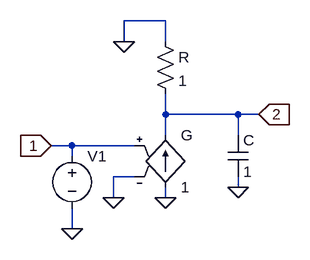
[diagram p0: schematic CS_ref_amp.asc]
CS_ref_amp.asc, the LTspice schematic file:
Version 4
SHEET 1 880 680
WIRE -64 -16 -128 -16
WIRE -128 16 -128 -16
WIRE -64 16 -64 -16
WIRE -64 128 -64 96
WIRE 48 128 -64 128
WIRE 80 128 48 128
WIRE -64 160 -64 128
WIRE 48 160 48 128
WIRE -208 176 -240 176
WIRE -112 176 -208 176
WIRE -208 192 -208 176
WIRE -112 224 -144 224
WIRE 48 240 48 224
WIRE -144 256 -144 224
WIRE -64 256 -64 240
WIRE -208 304 -208 272
FLAG -64 256 0
FLAG -240 176 1
IOPIN -240 176 In
FLAG 48 240 0
FLAG 80 128 2
IOPIN 80 128 In
FLAG -128 16 0
FLAG -144 256 0
FLAG -208 304 0
SYMBOL res -80 0 R0
SYMATTR InstName R
SYMATTR Value 1
SYMBOL cap 32 160 R0
SYMATTR InstName C
SYMATTR Value 1
SYMBOL voltage -208 176 R0
WINDOW 3 24 96 Invisible 2
WINDOW 123 0 0 Left 0
WINDOW 39 0 0 Left 0
SYMATTR Value 1
SYMATTR InstName V1
SYMBOL g -64 144 R0
SYMATTR InstName G
SYMATTR Value 1

The netlist it stands for:
* CS_ref_amp.asc
R 0 2 1
C 2 0 1
V1 1 0 1
G 0 2 1 0 1
.backanno
.end